# EAGLE design flat bridge (EAGLE 6.5.0)
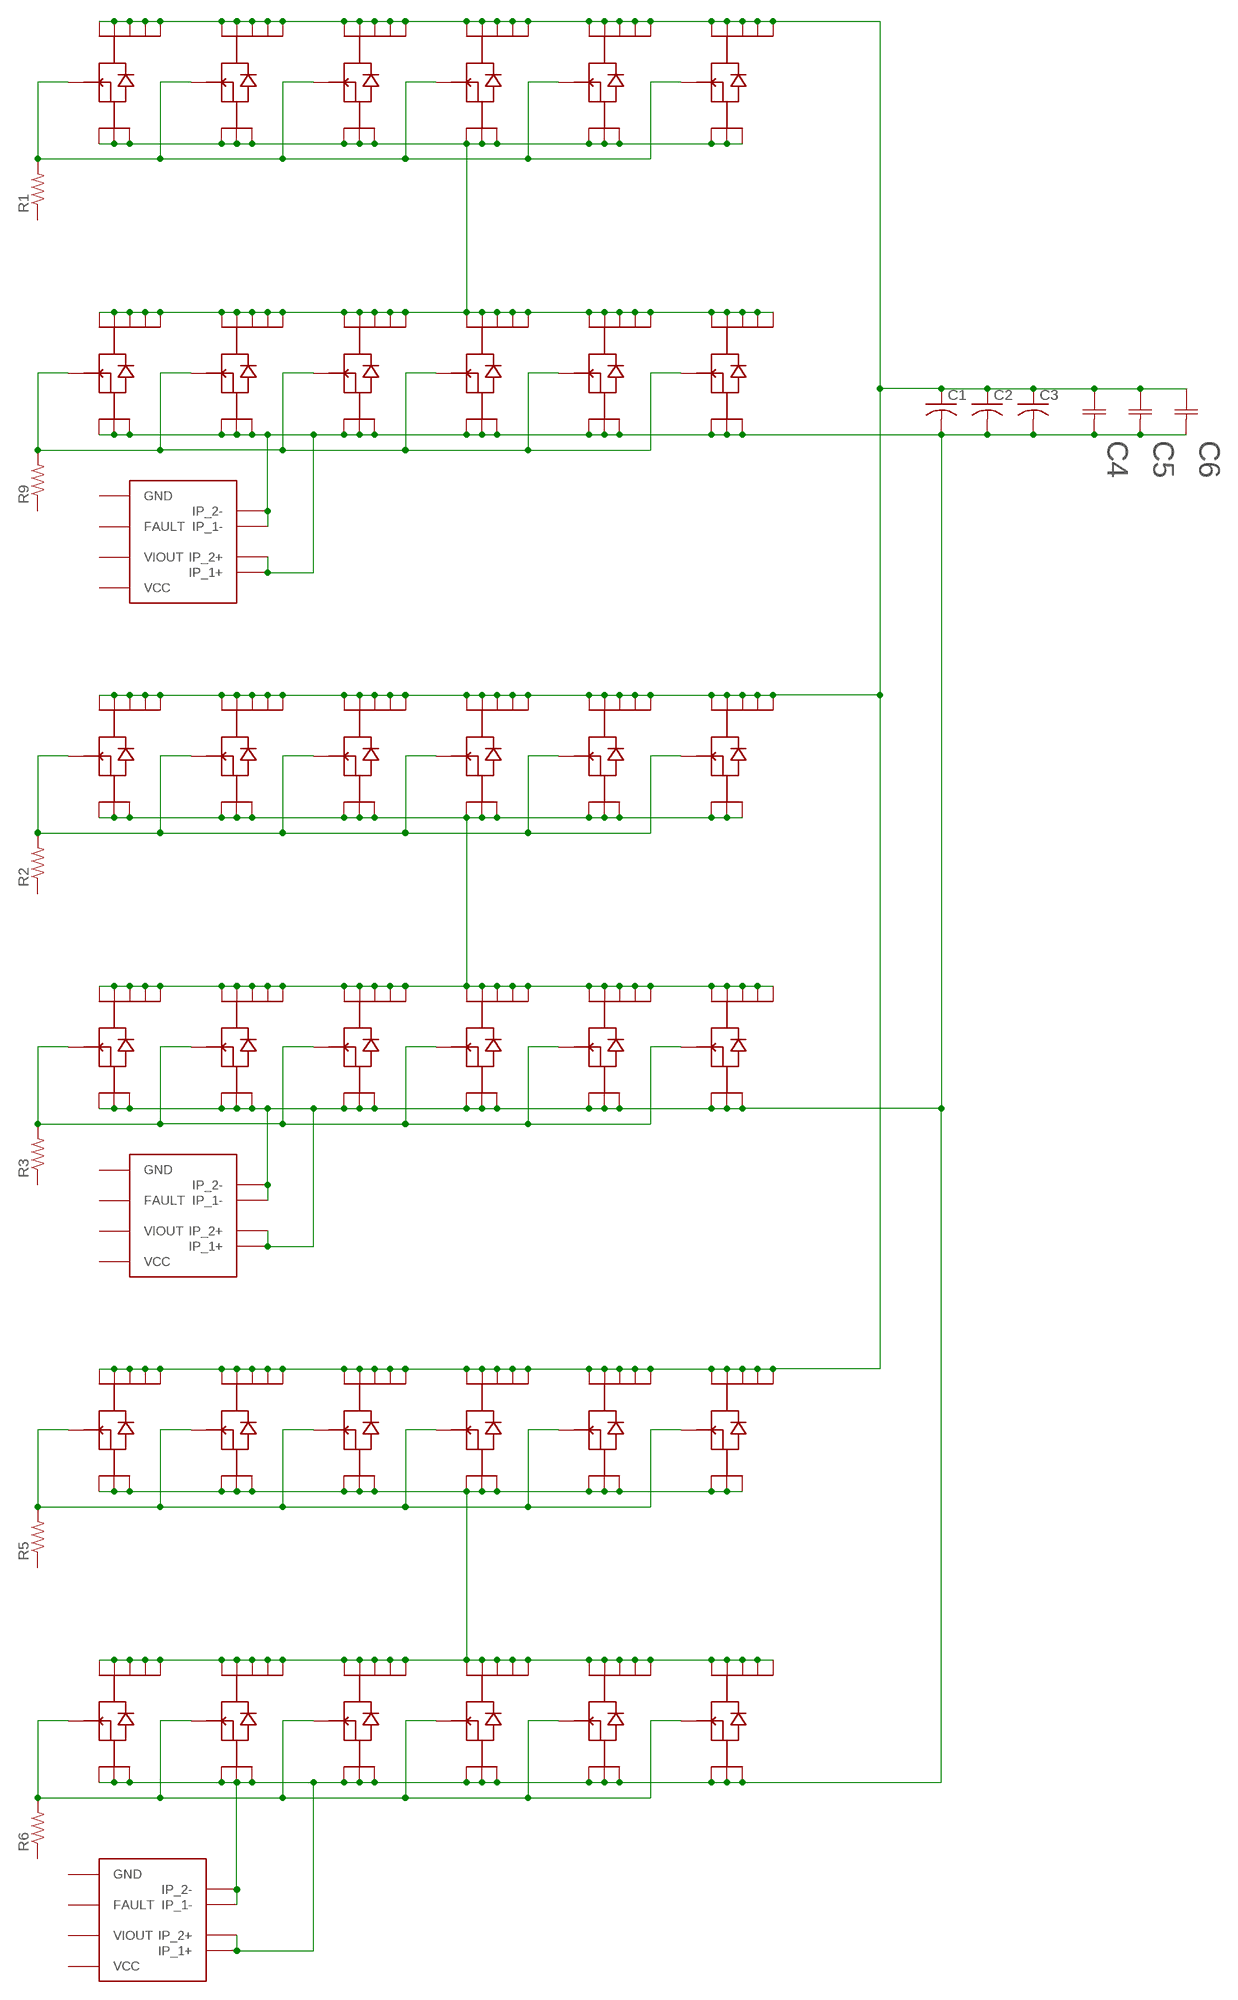
[diagram p0: schematic, sheet 1]

## Parts
C1  C-USC2220K  [C2220K]
C2  C-USC2220K  [C2220K]
C3  C-USC2220K  [C2220K]
C4  EEVFK1J471M  [CAP_EEFK_J16]
C5  EEVFK1J471M  [CAP_EEFK_J16]
C6  EEVFK1J471M  [CAP_EEFK_J16]
R1  R-US_R1206  [R1206]
R2  R-US_R1206  [R1206]
R3  R-US_R1206  [R1206]
R5  R-US_R1206  [R1206]
R6  R-US_R1206  [R1206]
R9  R-US_R1206  [R1206]
U$1  TPH2R608NH  [SOP-ADVANCE]
U$2  TPH2R608NH  [SOP-ADVANCE]
U$3  TPH2R608NH  [SOP-ADVANCE]
U$4  TPH2R608NH  [SOP-ADVANCE]
U$5  TPH2R608NH  [SOP-ADVANCE]
U$6  TPH2R608NH  [SOP-ADVANCE]
U$7  ACS711  [SO8]
U$8  TPH2R608NH  [SOP-ADVANCE]
U$9  TPH2R608NH  [SOP-ADVANCE]
U$10  TPH2R608NH  [SOP-ADVANCE]
U$11  TPH2R608NH  [SOP-ADVANCE]
U$12  TPH2R608NH  [SOP-ADVANCE]
U$13  TPH2R608NH  [SOP-ADVANCE]
U$14  TPH2R608NH  [SOP-ADVANCE]
U$15  TPH2R608NH  [SOP-ADVANCE]
U$16  TPH2R608NH  [SOP-ADVANCE]
U$17  TPH2R608NH  [SOP-ADVANCE]
U$18  TPH2R608NH  [SOP-ADVANCE]
U$19  TPH2R608NH  [SOP-ADVANCE]
U$21  TPH2R608NH  [SOP-ADVANCE]
U$22  TPH2R608NH  [SOP-ADVANCE]
U$23  TPH2R608NH  [SOP-ADVANCE]
U$24  TPH2R608NH  [SOP-ADVANCE]
U$25  TPH2R608NH  [SOP-ADVANCE]
U$26  TPH2R608NH  [SOP-ADVANCE]
U$28  ACS711  [SO8]
U$29  TPH2R608NH  [SOP-ADVANCE]
U$30  TPH2R608NH  [SOP-ADVANCE]
U$31  TPH2R608NH  [SOP-ADVANCE]
U$32  TPH2R608NH  [SOP-ADVANCE]
U$33  TPH2R608NH  [SOP-ADVANCE]
U$34  TPH2R608NH  [SOP-ADVANCE]
U$35  TPH2R608NH  [SOP-ADVANCE]
U$36  TPH2R608NH  [SOP-ADVANCE]
U$37  TPH2R608NH  [SOP-ADVANCE]
U$38  TPH2R608NH  [SOP-ADVANCE]
U$39  TPH2R608NH  [SOP-ADVANCE]
U$40  TPH2R608NH  [SOP-ADVANCE]
U$42  ACS711  [SO8]

## Nets
N$1: R1.2 U$1.4(G) U$2.4(G) U$3.4(G) U$4.4(G) U$5.4(G) U$6.4(G)
N$2: C1.1 C2.1 C3.1 C4.1 C5.1 C6.1 U$1.5(D1) U$1.6(D2) U$1.7(D3) U$1.8(D4) U$1.9(DTAB) U$2.5(D1) U$2.6(D2) U$2.7(D3) U$2.8(D4) U$2.9(DTAB) U$3.5(D1) U$3.6(D2) U$3.7(D3) U$3.8(D4) U$3.9(DTAB) U$4.5(D1) U$4.6(D2) U$4.7(D3) U$4.8(D4) U$4.9(DTAB) U$5.5(D1) U$5.6(D2) U$5.7(D3) U$5.8(D4) U$5.9(DTAB) U$6.5(D1) U$6.6(D2) U$6.7(D3) U$6.8(D4) U$6.9(DTAB) U$8.5(D1) U$8.6(D2) U$8.7(D3) U$8.8(D4) U$8.9(DTAB) U$15.5(D1) U$15.6(D2) U$15.7(D3) U$15.8(D4) U$15.9(DTAB) U$16.5(D1) U$16.6(D2) U$16.7(D3) U$16.8(D4) U$16.9(DTAB) U$17.5(D1) U$17.6(D2) U$17.7(D3) U$17.8(D4) U$17.9(DTAB) U$18.5(D1) U$18.6(D2) U$18.7(D3) U$18.8(D4) U$18.9(DTAB) U$19.5(D1) U$19.6(D2) U$19.7(D3) U$19.8(D4) U$19.9(DTAB) U$29.5(D1) U$29.6(D2) U$29.7(D3) U$29.8(D4) U$29.9(DTAB) U$30.5(D1) U$30.6(D2) U$30.7(D3) U$30.8(D4) U$30.9(DTAB) U$31.5(D1) U$31.6(D2) U$31.7(D3) U$31.8(D4) U$31.9(DTAB) U$32.5(D1) U$32.6(D2) U$32.7(D3) U$32.8(D4) U$32.9(DTAB) U$33.5(D1) U$33.6(D2) U$33.7(D3) U$33.8(D4) U$33.9(DTAB) U$34.5(D1) U$34.6(D2) U$34.7(D3) U$34.8(D4) U$34.9(DTAB)
N$3: R9.2 U$9.4(G) U$10.4(G) U$11.4(G) U$12.4(G) U$13.4(G) U$14.4(G)
N$4: R2.2 U$8.4(G) U$15.4(G) U$16.4(G) U$17.4(G) U$18.4(G) U$19.4(G)
N$6: U$8.1(S1) U$8.2(S2) U$8.3(S3) U$15.1(S1) U$15.2(S2) U$15.3(S3) U$16.1(S1) U$16.2(S2) U$16.3(S3) U$17.1(S1) U$17.2(S2) U$17.3(S3) U$18.1(S1) U$18.2(S2) U$18.3(S3) U$19.1(S1) U$19.2(S2) U$19.3(S3) U$21.5(D1) U$21.6(D2) U$21.7(D3) U$21.8(D4) U$21.9(DTAB) U$22.5(D1) U$22.6(D2) U$22.7(D3) U$22.8(D4) U$22.9(DTAB) U$23.5(D1) U$23.6(D2) U$23.7(D3) U$23.8(D4) U$23.9(DTAB) U$24.5(D1) U$24.6(D2) U$24.7(D3) U$24.8(D4) U$24.9(DTAB) U$25.5(D1) U$25.6(D2) U$25.7(D3) U$25.8(D4) U$25.9(DTAB) U$26.5(D1) U$26.6(D2) U$26.7(D3) U$26.8(D4) U$26.9(DTAB)
N$7: R3.2 U$21.4(G) U$22.4(G) U$23.4(G) U$24.4(G) U$25.4(G) U$26.4(G)
N$10: R5.2 U$29.4(G) U$30.4(G) U$31.4(G) U$32.4(G) U$33.4(G) U$34.4(G)
N$12: U$29.1(S1) U$29.2(S2) U$29.3(S3) U$30.1(S1) U$30.2(S2) U$30.3(S3) U$31.1(S1) U$31.2(S2) U$31.3(S3) U$32.1(S1) U$32.2(S2) U$32.3(S3) U$33.1(S1) U$33.2(S2) U$33.3(S3) U$34.1(S1) U$34.2(S2) U$34.3(S3) U$35.5(D1) U$35.6(D2) U$35.7(D3) U$35.8(D4) U$35.9(DTAB) U$36.5(D1) U$36.6(D2) U$36.7(D3) U$36.8(D4) U$36.9(DTAB) U$37.5(D1) U$37.6(D2) U$37.7(D3) U$37.8(D4) U$37.9(DTAB) U$38.5(D1) U$38.6(D2) U$38.7(D3) U$38.8(D4) U$38.9(DTAB) U$39.5(D1) U$39.6(D2) U$39.7(D3) U$39.8(D4) U$39.9(DTAB) U$40.5(D1) U$40.6(D2) U$40.7(D3) U$40.8(D4) U$40.9(DTAB)
N$14: C1.2 C2.2 C3.2 C4.2 C5.2 C6.2 U$7.1(IP_1+) U$7.2(IP_2+) U$7.3(IP_1-) U$7.4(IP_2-) U$9.1(S1) U$9.2(S2) U$9.3(S3) U$10.1(S1) U$10.2(S2) U$10.3(S3) U$11.1(S1) U$11.2(S2) U$11.3(S3) U$12.1(S1) U$12.2(S2) U$12.3(S3) U$13.1(S1) U$13.2(S2) U$13.3(S3) U$14.1(S1) U$14.2(S2) U$14.3(S3) U$21.1(S1) U$21.2(S2) U$21.3(S3) U$22.1(S1) U$22.2(S2) U$22.3(S3) U$23.1(S1) U$23.2(S2) U$23.3(S3) U$24.1(S1) U$24.2(S2) U$24.3(S3) U$25.1(S1) U$25.2(S2) U$25.3(S3) U$26.1(S1) U$26.2(S2) U$26.3(S3) U$28.1(IP_1+) U$28.2(IP_2+) U$28.3(IP_1-) U$28.4(IP_2-) U$35.1(S1) U$35.2(S2) U$35.3(S3) U$36.1(S1) U$36.2(S2) U$36.3(S3) U$37.1(S1) U$37.2(S2) U$37.3(S3) U$38.1(S1) U$38.2(S2) U$38.3(S3) U$39.1(S1) U$39.2(S2) U$39.3(S3) U$40.1(S1) U$40.2(S2) U$40.3(S3) U$42.1(IP_1+) U$42.2(IP_2+) U$42.3(IP_1-) U$42.4(IP_2-)
N$16: R6.2 U$35.4(G) U$36.4(G) U$37.4(G) U$38.4(G) U$39.4(G) U$40.4(G)
N$19: U$1.1(S1) U$1.2(S2) U$1.3(S3) U$2.1(S1) U$2.2(S2) U$2.3(S3) U$3.1(S1) U$3.2(S2) U$3.3(S3) U$4.1(S1) U$4.2(S2) U$4.3(S3) U$5.1(S1) U$5.2(S2) U$5.3(S3) U$6.1(S1) U$6.2(S2) U$6.3(S3) U$9.5(D1) U$9.6(D2) U$9.7(D3) U$9.8(D4) U$9.9(DTAB) U$10.5(D1) U$10.6(D2) U$10.7(D3) U$10.8(D4) U$10.9(DTAB) U$11.5(D1) U$11.6(D2) U$11.7(D3) U$11.8(D4) U$11.9(DTAB) U$12.5(D1) U$12.6(D2) U$12.7(D3) U$12.8(D4) U$12.9(DTAB) U$13.5(D1) U$13.6(D2) U$13.7(D3) U$13.8(D4) U$13.9(DTAB) U$14.5(D1) U$14.6(D2) U$14.7(D3) U$14.8(D4) U$14.9(DTAB)
Unconnected: R1.1 R2.1 R3.1 R5.1 R6.1 R9.1 U$7.5(GND) U$7.6(FAULT) U$7.7(VIOUT) U$7.8(VCC) U$28.5(GND) U$28.6(FAULT) U$28.7(VIOUT) U$28.8(VCC) U$42.5(GND) U$42.6(FAULT) U$42.7(VIOUT) U$42.8(VCC)

## Library data of the parts
C1-C3 = rcl:C-US: CAPACITOR, American symbol
C4-C6 = brushlessrage:EEVFK1J471M; COPYRIGHT: Copyright (C) 2015 Accelerated Designs. All rights reserved; MANUFACTURER_PART_NUMBER: EEVFK1J471M; VENDOR: Panasonic
R1-R3 R5 R6 R9 = resistor:R-US_: RESISTOR, American symbol
U$1-U$6 U$8-U$19 U$21-U$26 U$29-U$40 = brushlessrage:TPH2R608NH
U$7 U$28 U$42 = brushlessrage:ACS711

## Board
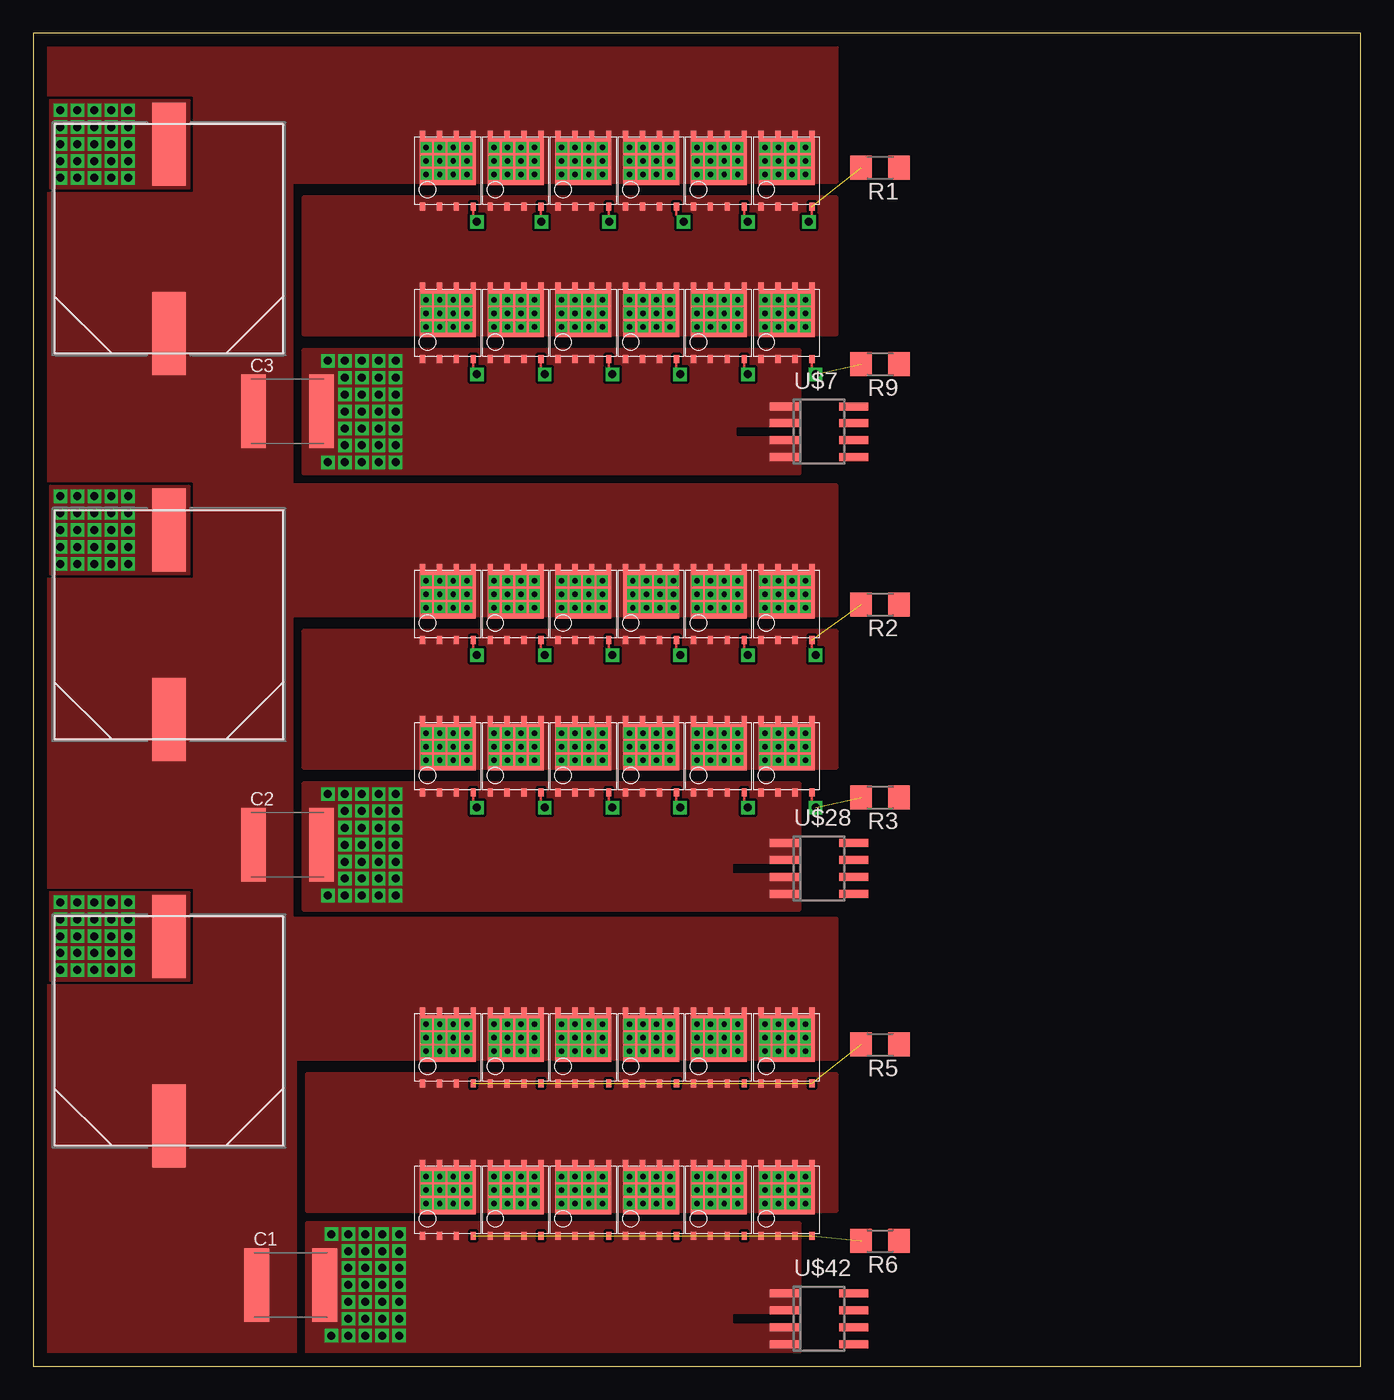
[diagram p1: board, top side]
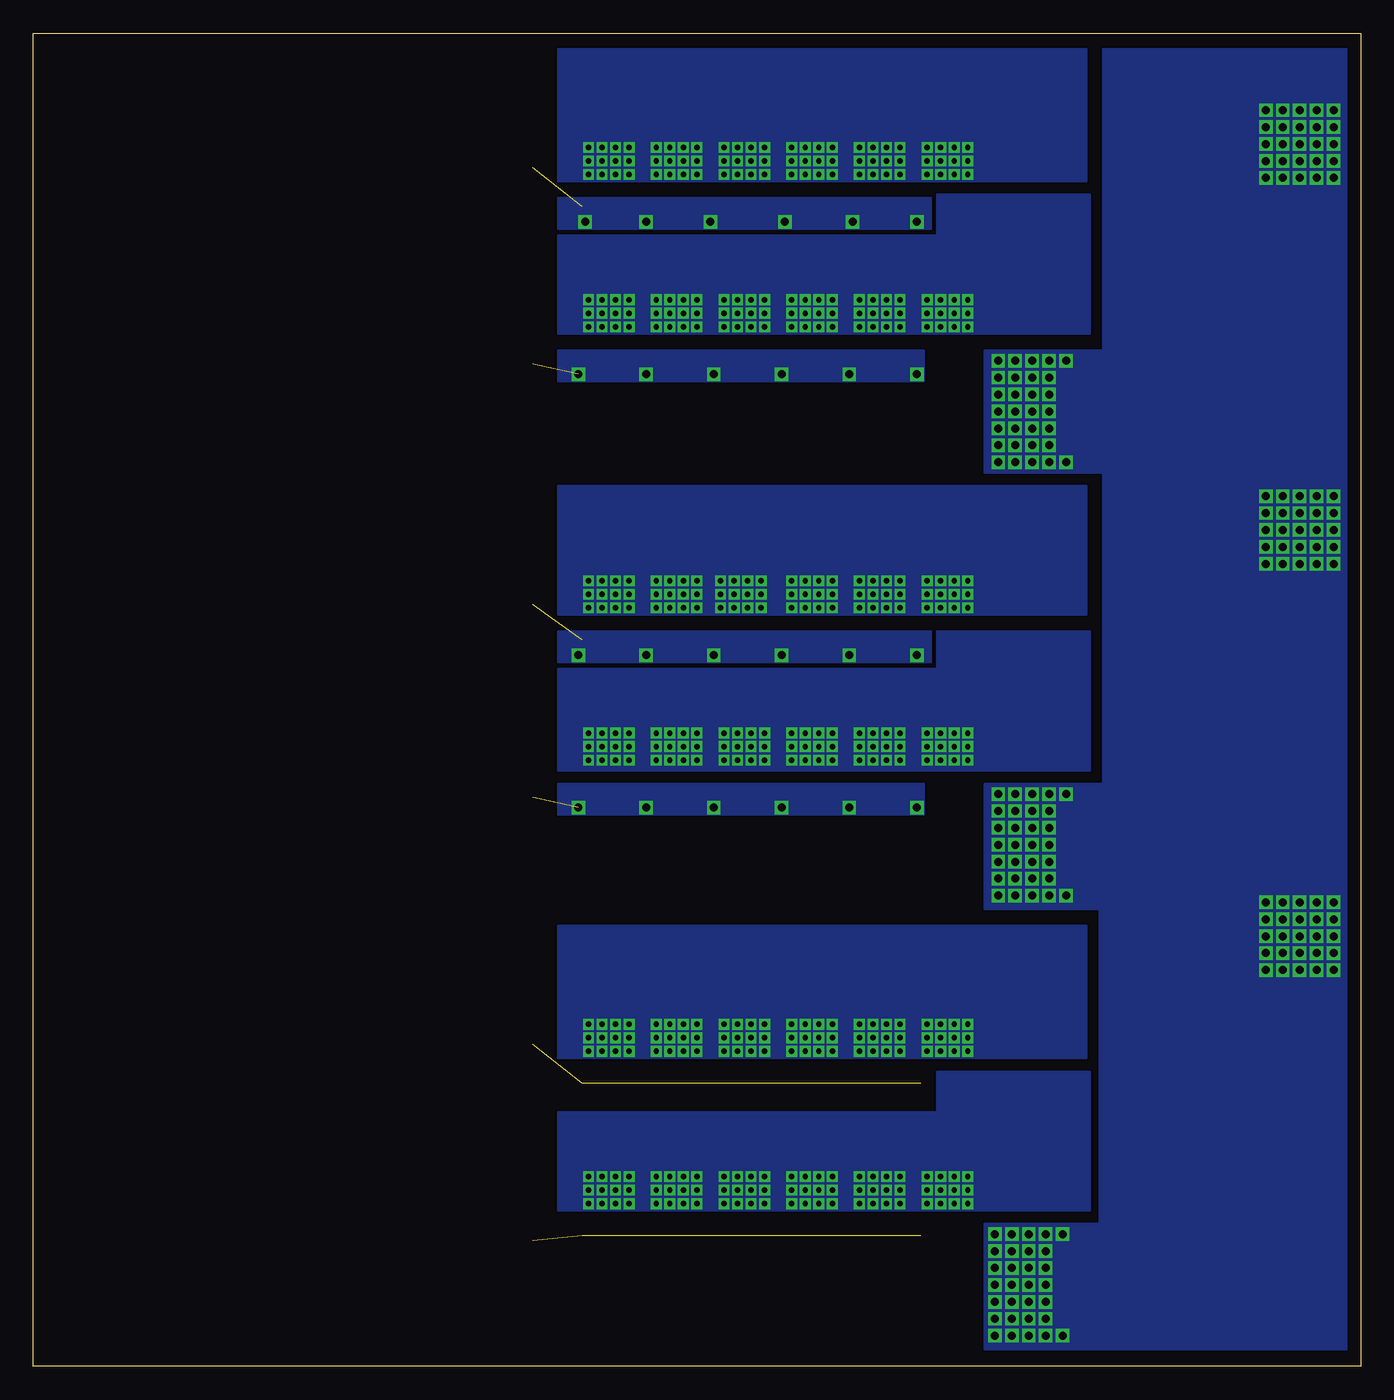
[diagram p2: board, bottom side, seen from below]

Size 99.55 x 100 mm. Coordinates in mm from the lower left corner, seen from the top.
Outline: 0,0 99.55,0 99.55,100 0,100 0,0
Copper layers (1*16): Top 0.035mm / dielectric 1.5mm / Bottom 0.035mm
Design rules "default": minimum track width 10mil, minimum drill 24mil, track to track 8mil, track to pad 8mil, pad to pad 8mil, via to via 8mil, smd to smd 8mil, copper to edge 40mil, drill to drill 8mil, minimum pad ring 10mil, minimum via ring 8mil, stop-mask expansion 4mil, vias tented up to drill 0mil, thermal gap 10mil
tRestrict: area 52.8,69.9 to 57.7,70.4; area 52.6,37.1 to 57.4,37.6; area 52.6,3.3 to 57.4,3.8

### Footprints (pad centres in the part's own frame; a part is rotated, then mirrored left to right if it is on the bottom)
C2220K = smd 1.85 x 5.5: 1 -2.55,0; 2 2.55,0
CAP_EEFK_J16 = smd 6.223 x 2.515: 1 -7.099,0; 2 7.099,0
R1206 = smd 1.6 x 1.803: 1 -1.422,0; 2 1.422,0
SOP-ADVANCE = smd 0.4 x 0.6: 1 -1.803,-3.175; 2 -0.533,-3.175; 3 0.737,-3.175; 4 2.007,-3.175; 5 2.007,2.235; 6 0.737,2.235; 7 -0.533,2.235; 8 -1.803,2.235 | smd 4.2 x 3.5: 9 0.102,0.203
SO8 = smd 0.6 x 2.2: 1 -1.905,-2.6; 2 -0.635,-2.6; 3 0.635,-2.6; 4 1.905,-2.6; 5 1.905,2.6; 6 0.635,2.6; 7 -0.635,2.6; 8 -1.905,2.6

### Placement (x,y rotation side)
C1  19.3,6.1 0 top
C2  19.05,39.12 0 top
C3  19.05,71.63 0 top
C4  10.16,84.58 90 top
C5  10.16,55.63 90 top
C6  10.16,25.15 90 top
R1  63.5,89.92 180 top
R2  63.5,57.15 180 top
R3  63.5,42.67 180 top
R5  63.5,24.13 180 top
R6  63.5,9.4 180 top
R9  63.5,75.18 180 top
U$1  56.39,90.17 0 top
U$2  51.31,90.17 0 top
U$3  46.23,90.17 0 top
U$4  41.15,90.17 0 top
U$5  36.07,90.17 0 top
U$6  30.99,90.17 0 top
U$7  58.93,70.1 270 top
U$8  30.99,57.66 0 top
U$9  30.99,78.74 0 top
U$10  36.07,78.74 0 top
U$11  41.15,78.74 0 top
U$12  46.23,78.74 0 top
U$13  51.31,78.74 0 top
U$14  56.39,78.74 0 top
U$15  36.07,57.66 0 top
U$16  41.15,57.66 0 top
U$17  46.23,57.66 0 top
U$18  51.31,57.66 0 top
U$19  56.39,57.66 0 top
U$21  56.39,46.23 0 top
U$22  30.99,46.23 0 top
U$23  36.07,46.23 0 top
U$24  41.15,46.23 0 top
U$25  46.23,46.23 0 top
U$26  51.31,46.23 0 top
U$28  58.93,37.34 270 top
U$29  30.99,24.38 0 top
U$30  36.07,24.38 0 top
U$31  41.15,24.38 0 top
U$32  46.23,24.38 0 top
U$33  51.31,24.38 0 top
U$34  56.39,24.38 0 top
U$35  56.39,12.95 0 top
U$36  51.31,12.95 0 top
U$37  46.23,12.95 0 top
U$38  41.15,12.95 0 top
U$39  36.07,12.95 0 top
U$40  30.99,12.95 0 top
U$42  58.93,3.56 270 top

### Tracks (layer width: path | path; a pad name or v marks a point on that pad's centre or on a via)
N$1  (via drill 0.6)  (1 unrouted)
  Top 0.203: U$6.4 33,86.13 v33.27,85.85 | U$5.4 38.08,85.88 v38.1,85.85 | U$4.4 43.16,85.88 v43.18,85.85 | U$3.4 48.23,86.39 v48.77,85.85 | U$2.4 53.31,86.13 v53.59,85.85 | U$1.4 58.39,86.08 v58.17,85.85
  pour Bottom (no thermals): 32.26,87.63 60.2,87.63 60.2,85.34 32.26,85.34
N$2  (via drill 0.41)
  other vias: 29.46,91.44 30.48,91.44 30.48,91.44 31.5,91.44 32.51,91.44 29.46,90.42 30.48,90.42 30.48,90.42 31.5,90.42 32.51,90.42 29.46,89.41 30.48,89.41 30.48,89.41 31.5,89.41 32.51,89.41 34.54,91.44 35.56,91.44 35.56,91.44 36.58,91.44 37.59,91.44 34.54,90.42 35.56,90.42 35.56,90.42 36.58,90.42 37.59,90.42 34.54,89.41 35.56,89.41 35.56,89.41 36.58,89.41 37.59,89.41 39.62,91.44 40.64,91.44 40.64,91.44 41.66,91.44 42.67,91.44 39.62,90.42 40.64,90.42 40.64,90.42 41.66,90.42 42.67,90.42 39.62,89.41 40.64,89.41 40.64,89.41 41.66,89.41 42.67,89.41 44.7,91.44 45.72,91.44 45.72,91.44 46.74,91.44 47.75,91.44 44.7,90.42 45.72,90.42 45.72,90.42 46.74,90.42 47.75,90.42 44.7,89.41 45.72,89.41 45.72,89.41 46.74,89.41 47.75,89.41 49.78,91.44 50.8,91.44 50.8,91.44 51.82,91.44 52.83,91.44 49.78,90.42 50.8,90.42 50.8,90.42 51.82,90.42 52.83,90.42 49.78,89.41 50.8,89.41 50.8,89.41 51.82,89.41 52.83,89.41 54.86,91.44 55.88,91.44 55.88,91.44 56.9,91.44 57.91,91.44 54.86,90.42 55.88,90.42 55.88,90.42 56.9,90.42 57.91,90.42 54.86,89.41 55.88,89.41 55.88,89.41 56.9,89.41 57.91,89.41 29.46,58.93 30.48,58.93 30.48,58.93 31.5,58.93 32.51,58.93 29.46,57.91 30.48,57.91 30.48,57.91 31.5,57.91 32.51,57.91 29.46,56.9 30.48,56.9 30.48,56.9 31.5,56.9 32.51,56.9 34.54,58.93 35.56,58.93 35.56,58.93 36.58,58.93 37.59,58.93 34.54,57.91 35.56,57.91 35.56,57.91 36.58,57.91 37.59,57.91 34.54,56.9 35.56,56.9 35.56,56.9 36.58,56.9 37.59,56.9 39.62,58.93 40.64,58.93 40.64,58.93 41.66,58.93 42.67,58.93 39.62,57.91 40.64,57.91 40.64,57.91 41.66,57.91 42.67,57.91 39.62,56.9 40.64,56.9 40.64,56.9 41.66,56.9 42.67,56.9 44.96,58.93 45.97,58.93 45.97,58.93 46.99,58.93 48.01,58.93 44.96,57.91 45.97,57.91 45.97,57.91 46.99,57.91 48.01,57.91 44.96,56.9 45.97,56.9 45.97,56.9 46.99,56.9 48.01,56.9 49.78,58.93 50.8,58.93 50.8,58.93 51.82,58.93 52.83,58.93 49.78,57.91 50.8,57.91 50.8,57.91 51.82,57.91 52.83,57.91 49.78,56.9 50.8,56.9 50.8,56.9 51.82,56.9 52.83,56.9 54.86,58.93 55.88,58.93 55.88,58.93 56.9,58.93 57.91,58.93 54.86,57.91 55.88,57.91 55.88,57.91 56.9,57.91 57.91,57.91 54.86,56.9 55.88,56.9 55.88,56.9 56.9,56.9 57.91,56.9 29.46,25.65 30.48,25.65 30.48,25.65 31.5,25.65 32.51,25.65 29.46,24.64 30.48,24.64 30.48,24.64 31.5,24.64 32.51,24.64 29.46,23.62 30.48,23.62 30.48,23.62 31.5,23.62 32.51,23.62 34.54,25.65 35.56,25.65 35.56,25.65 36.58,25.65 37.59,25.65 34.54,24.64 35.56,24.64 35.56,24.64 36.58,24.64 37.59,24.64 34.54,23.62 35.56,23.62 35.56,23.62 36.58,23.62 37.59,23.62 39.62,25.65 40.64,25.65 40.64,25.65 41.66,25.65 42.67,25.65 39.62,24.64 40.64,24.64 40.64,24.64 41.66,24.64 42.67,24.64 39.62,23.62 40.64,23.62 40.64,23.62 41.66,23.62 42.67,23.62 44.7,25.65 45.72,25.65 45.72,25.65 46.74,25.65 47.75,25.65 44.7,24.64 45.72,24.64 45.72,24.64 46.74,24.64 47.75,24.64 44.7,23.62 45.72,23.62 45.72,23.62 46.74,23.62 47.75,23.62 49.78,25.65 50.8,25.65 50.8,25.65 51.82,25.65 52.83,25.65 49.78,24.64 50.8,24.64 50.8,24.64 51.82,24.64 52.83,24.64 49.78,23.62 50.8,23.62 50.8,23.62 51.82,23.62 52.83,23.62 54.86,25.65 55.88,25.65 55.88,25.65 56.9,25.65 57.91,25.65 54.86,24.64 55.88,24.64 55.88,24.64 56.9,24.64 57.91,24.64 54.86,23.62 55.88,23.62 55.88,23.62 56.9,23.62 57.91,23.62
  pour Top (rank 2, no thermals): 0,99.31 60.2,99.31 60.2,88.9 19.3,88.9 19.3,66.04 60.2,66.04 60.2,56.39 19.3,56.39 19.3,33.53 60.2,33.53 60.2,23.11 19.56,23.11 19.56,0.51 0,0.76
  pour Bottom: 20.57,98.81 60.2,98.81 60.2,88.9 20.57,88.9
  pour Bottom: 20.57,66.04 60.2,66.04 60.2,56.39 20.57,56.39
  pour Bottom: 20.57,33.02 60.2,33.02 60.2,23.11 20.57,23.11
N$3  (via drill 0.6)  (1 unrouted)
  Top 0.203: U$9.4 33,74.7 v33.27,74.42 | U$10.4 38.08,74.7 v38.35,74.42 | U$11.4 43.16,74.7 v43.43,74.42 | U$12.4 48.23,74.7 v48.51,74.42 | U$13.4 53.31,74.7 v53.59,74.42 | U$14.4 58.39,74.7 v58.67,74.42
  pour Bottom (no thermals): 32.77,76.2 60.2,76.2 60.2,73.91 32.77,73.91
N$4  (via drill 0.6)  (1 unrouted)
  Top 0.203: U$8.4 33,53.62 v33.27,53.34 | U$15.4 38.08,53.62 v38.35,53.34 | U$16.4 43.16,53.62 v43.43,53.34 | U$17.4 48.23,53.62 v48.51,53.34 | U$18.4 53.31,53.62 v53.59,53.34 | U$19.4 58.39,53.62 v58.67,53.34
  pour Bottom (no thermals): 32.26,55.12 60.2,55.12 60.2,52.83 32.26,52.83
N$6  (via drill 0.41)
  other vias: 29.46,47.5 30.48,47.5 30.48,47.5 31.5,47.5 32.51,47.5 29.46,46.48 30.48,46.48 30.48,46.48 31.5,46.48 32.51,46.48 29.46,45.47 30.48,45.47 30.48,45.47 31.5,45.47 32.51,45.47 34.54,47.5 35.56,47.5 35.56,47.5 36.58,47.5 37.59,47.5 34.54,46.48 35.56,46.48 35.56,46.48 36.58,46.48 37.59,46.48 34.54,45.47 35.56,45.47 35.56,45.47 36.58,45.47 37.59,45.47 39.62,47.5 40.64,47.5 40.64,47.5 41.66,47.5 42.67,47.5 39.62,46.48 40.64,46.48 40.64,46.48 41.66,46.48 42.67,46.48 39.62,45.47 40.64,45.47 40.64,45.47 41.66,45.47 42.67,45.47 44.7,47.5 45.72,47.5 45.72,47.5 46.74,47.5 47.75,47.5 44.7,46.48 45.72,46.48 45.72,46.48 46.74,46.48 47.75,46.48 44.7,45.47 45.72,45.47 45.72,45.47 46.74,45.47 47.75,45.47 49.78,47.5 50.8,47.5 50.8,47.5 51.82,47.5 52.83,47.5 49.78,46.48 50.8,46.48 50.8,46.48 51.82,46.48 52.83,46.48 49.78,45.47 50.8,45.47 50.8,45.47 51.82,45.47 52.83,45.47 54.86,47.5 55.88,47.5 55.88,47.5 56.9,47.5 57.91,47.5 54.86,46.48 55.88,46.48 55.88,46.48 56.9,46.48 57.91,46.48 54.86,45.47 55.88,45.47 55.88,45.47 56.9,45.47 57.91,45.47
  pour Top (no thermals): 20.32,55.12 60.2,55.12 60.2,44.96 20.32,44.96
  pour Bottom: 20.32,55.12 31.75,55.12 31.75,52.32 60.2,52.32 60.2,44.7 20.32,44.7
N$7  (via drill 0.6)  (1 unrouted)
  Top 0.203: U$22.4 33,42.19 v33.27,41.91 | U$23.4 38.08,42.19 v38.35,41.91 | U$24.4 43.16,42.19 v43.43,41.91 | U$25.4 48.23,42.19 v48.51,41.91 | U$26.4 53.31,42.19 v53.59,41.91 | U$21.4 58.39,42.19 v58.67,41.91
  pour Bottom (no thermals): 32.77,43.69 60.2,43.69 60.2,41.4 32.77,41.4
N$10  (6 unrouted)
N$12  (via drill 0.41)
  other vias: 29.46,14.22 30.48,14.22 30.48,14.22 31.5,14.22 32.51,14.22 29.46,13.21 30.48,13.21 30.48,13.21 31.5,13.21 32.51,13.21 29.46,12.19 30.48,12.19 30.48,12.19 31.5,12.19 32.51,12.19 34.54,14.22 35.56,14.22 35.56,14.22 36.58,14.22 37.59,14.22 34.54,13.21 35.56,13.21 35.56,13.21 36.58,13.21 37.59,13.21 34.54,12.19 35.56,12.19 35.56,12.19 36.58,12.19 37.59,12.19 39.62,14.22 40.64,14.22 40.64,14.22 41.66,14.22 42.67,14.22 39.62,13.21 40.64,13.21 40.64,13.21 41.66,13.21 42.67,13.21 39.62,12.19 40.64,12.19 40.64,12.19 41.66,12.19 42.67,12.19 44.7,14.22 45.72,14.22 45.72,14.22 46.74,14.22 47.75,14.22 44.7,13.21 45.72,13.21 45.72,13.21 46.74,13.21 47.75,13.21 44.7,12.19 45.72,12.19 45.72,12.19 46.74,12.19 47.75,12.19 49.78,14.22 50.8,14.22 50.8,14.22 51.82,14.22 52.83,14.22 49.78,13.21 50.8,13.21 50.8,13.21 51.82,13.21 52.83,13.21 49.78,12.19 50.8,12.19 50.8,12.19 51.82,12.19 52.83,12.19 54.86,14.22 55.88,14.22 55.88,14.22 56.9,14.22 57.91,14.22 54.86,13.21 55.88,13.21 55.88,13.21 56.9,13.21 57.91,13.21 54.86,12.19 55.88,12.19 55.88,12.19 56.9,12.19 57.91,12.19
  pour Top (no thermals): 20.57,21.84 60.2,21.84 60.2,11.68 20.57,11.68
  pour Bottom: 20.32,22.1 31.75,22.1 31.75,19.05 60.2,19.05 60.2,11.68 20.32,11.68
N$14  (via drill 0.6)
  other vias: 23.37,75.44 24.64,75.44 25.91,75.44 27.18,75.44 27.18,74.17 25.91,74.17 24.64,74.17 23.37,74.17 23.37,72.9 24.64,72.9 25.91,72.9 27.18,72.9 23.37,42.93 24.64,42.93 25.91,42.93 27.18,42.93 27.18,41.66 25.91,41.66 24.64,41.66 23.37,41.66 23.37,40.39 24.64,40.39 25.91,40.39 27.18,40.39 23.37,39.12 24.64,39.12 25.91,39.12 27.18,39.12 27.18,37.85 25.91,37.85 24.64,37.85 23.37,37.85 23.37,36.58 24.64,36.58 25.91,36.58 27.18,36.58 23.37,71.63 24.64,71.63 25.91,71.63 27.18,71.63 27.18,70.36 25.91,70.36 24.64,70.36 23.37,70.36 23.37,69.09 24.64,69.09 25.91,69.09 27.18,69.09 23.62,9.91 24.89,9.91 26.16,9.91 27.43,9.91 27.43,8.64 26.16,8.64 24.89,8.64 23.62,8.64 23.62,7.37 24.89,7.37 26.16,7.37 27.43,7.37 23.62,6.1 24.89,6.1 26.16,6.1 27.43,6.1 27.43,4.83 26.16,4.83 24.89,4.83 23.62,4.83 23.62,3.56 24.89,3.56 26.16,3.56 27.43,3.56 23.37,67.82 24.64,67.82 25.91,67.82 27.18,67.82 22.1,67.82 22.1,75.44 22.1,42.93 22.1,35.31 23.37,35.31 24.64,35.31 25.91,35.31 27.18,35.31 22.35,9.91 23.62,2.29 24.89,2.29 26.16,2.29 27.43,2.29 22.35,2.29 2.03,94.23 3.3,94.23 4.57,94.23 5.84,94.23 7.11,94.23 2.03,92.96 3.3,92.96 4.57,92.96 5.84,92.96 7.11,92.96 2.03,91.69 3.3,91.69 4.57,91.69 5.84,91.69 7.11,91.69 2.03,90.42 3.3,90.42 4.57,90.42 5.84,90.42 7.11,90.42 2.03,89.15 3.3,89.15 4.57,89.15 5.84,89.15 7.11,89.15 2.03,65.28 3.3,65.28 4.57,65.28 5.84,65.28 7.11,65.28 2.03,64.01 3.3,64.01 4.57,64.01 5.84,64.01 7.11,64.01 2.03,62.74 3.3,62.74 4.57,62.74 5.84,62.74 7.11,62.74 2.03,61.47 3.3,61.47 4.57,61.47 5.84,61.47 7.11,61.47 2.03,60.2 3.3,60.2 4.57,60.2 5.84,60.2 7.11,60.2 2.03,34.8 3.3,34.8 4.57,34.8 5.84,34.8 7.11,34.8 2.03,33.53 3.3,33.53 4.57,33.53 5.84,33.53 7.11,33.53 2.03,32.26 3.3,32.26 4.57,32.26 5.84,32.26 7.11,32.26 2.03,30.99 3.3,30.99 4.57,30.99 5.84,30.99 7.11,30.99 2.03,29.72 3.3,29.72 4.57,29.72 5.84,29.72 7.11,29.72
  pour Top (no thermals): 20.32,76.2 57.4,76.2 57.4,67.06 20.32,67.06
  pour Top (no thermals): 20.32,43.69 57.4,43.69 57.4,34.29 20.32,34.29
  pour Top (no thermals): 20.57,10.67 57.4,10.67 57.4,1.02 20.57,1.02
  pour Bottom: 1.02,98.81 19.3,98.81 19.3,76.2 28.19,76.2 28.19,67.06 19.3,67.06 19.3,43.69 28.19,43.69 28.19,34.29 19.56,34.29 19.56,10.67 28.19,10.67 28.19,1.27 1.02,1.27
  pour Top (no thermals): 1.27,95 11.68,95 11.68,88.39 1.27,88.39
  pour Top (no thermals): 1.27,66.04 11.68,66.04 11.68,59.44 1.27,59.44
  pour Top (no thermals): 1.27,35.56 11.68,35.56 11.68,28.96 1.27,28.96
N$16  (6 unrouted)
N$19  (via drill 0.41)
  other vias: 29.46,80.01 30.48,80.01 30.48,80.01 31.5,80.01 32.51,80.01 29.46,78.99 30.48,78.99 30.48,78.99 31.5,78.99 32.51,78.99 29.46,77.98 30.48,77.98 30.48,77.98 31.5,77.98 32.51,77.98 34.54,80.01 35.56,80.01 35.56,80.01 36.58,80.01 37.59,80.01 34.54,78.99 35.56,78.99 35.56,78.99 36.58,78.99 37.59,78.99 34.54,77.98 35.56,77.98 35.56,77.98 36.58,77.98 37.59,77.98 39.62,80.01 40.64,80.01 40.64,80.01 41.66,80.01 42.67,80.01 39.62,78.99 40.64,78.99 40.64,78.99 41.66,78.99 42.67,78.99 39.62,77.98 40.64,77.98 40.64,77.98 41.66,77.98 42.67,77.98 44.7,80.01 45.72,80.01 45.72,80.01 46.74,80.01 47.75,80.01 44.7,78.99 45.72,78.99 45.72,78.99 46.74,78.99 47.75,78.99 44.7,77.98 45.72,77.98 45.72,77.98 46.74,77.98 47.75,77.98 49.78,80.01 50.8,80.01 50.8,80.01 51.82,80.01 52.83,80.01 49.78,78.99 50.8,78.99 50.8,78.99 51.82,78.99 52.83,78.99 49.78,77.98 50.8,77.98 50.8,77.98 51.82,77.98 52.83,77.98 54.86,80.01 55.88,80.01 55.88,80.01 56.9,80.01 57.91,80.01 54.86,78.99 55.88,78.99 55.88,78.99 56.9,78.99 57.91,78.99 54.86,77.98 55.88,77.98 55.88,77.98 56.9,77.98 57.91,77.98
  pour Top (no thermals): 20.32,87.63 60.2,87.63 60.2,77.47 20.32,77.47
  pour Bottom: 20.32,87.88 31.75,87.88 31.75,84.84 60.2,84.84 60.2,77.47 20.32,77.47